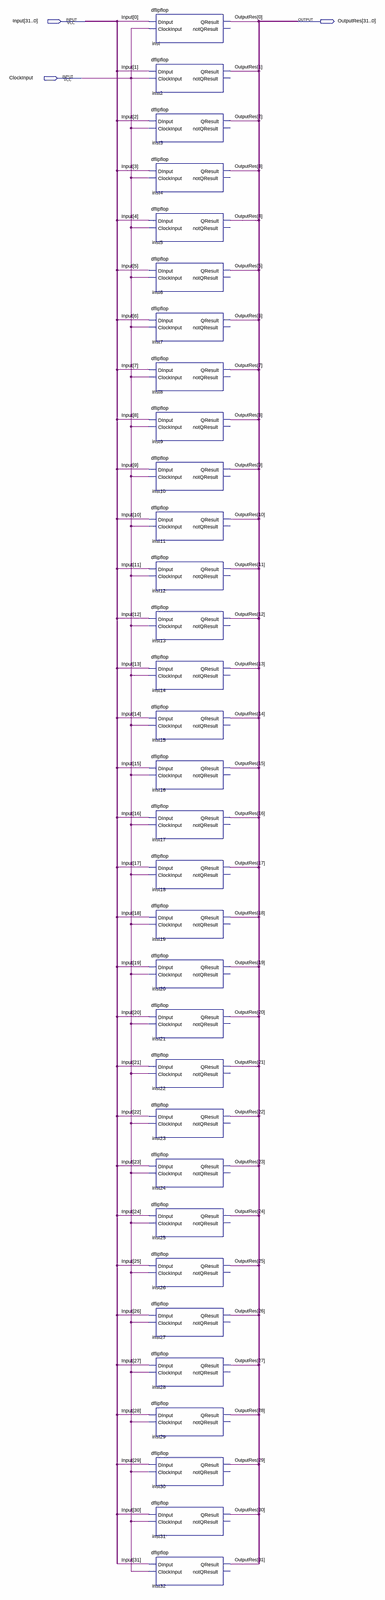
[diagram p0: schematic sheet, whole]
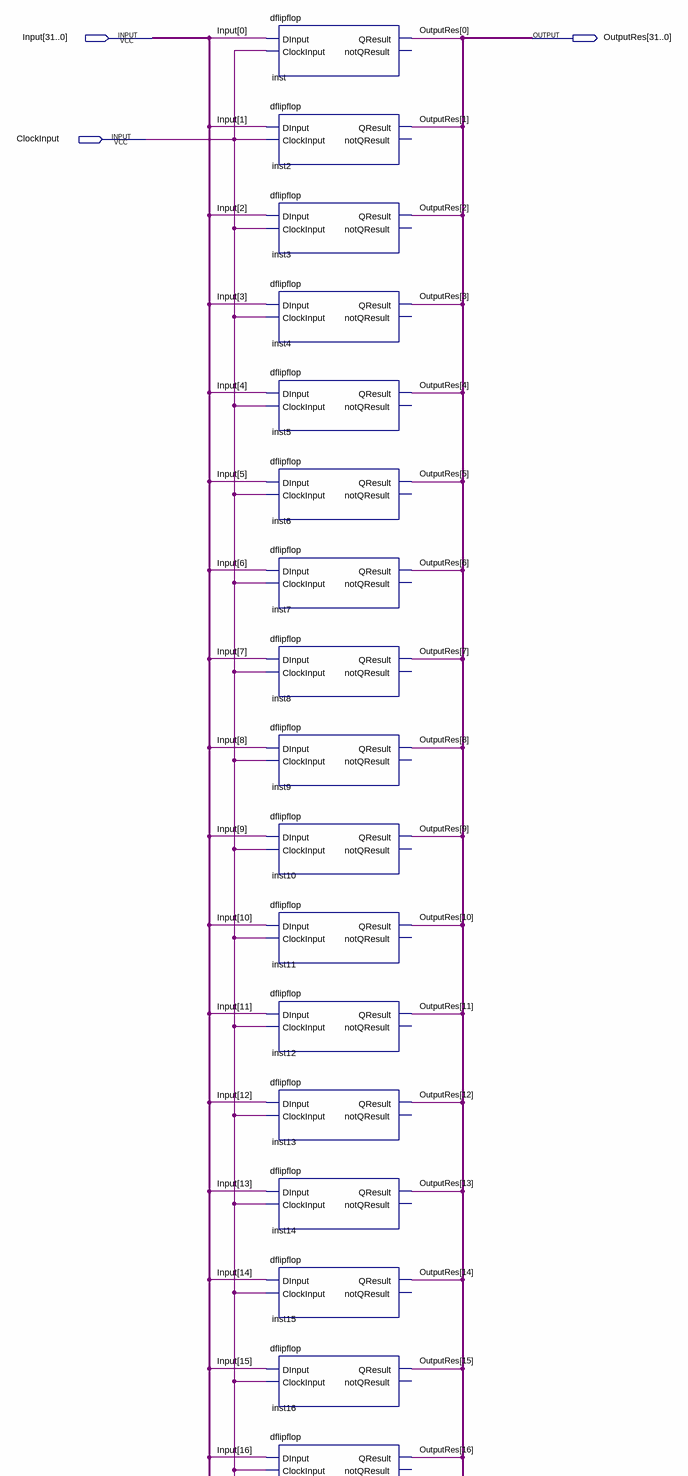
[diagram p1: schematic sheet, upper part]
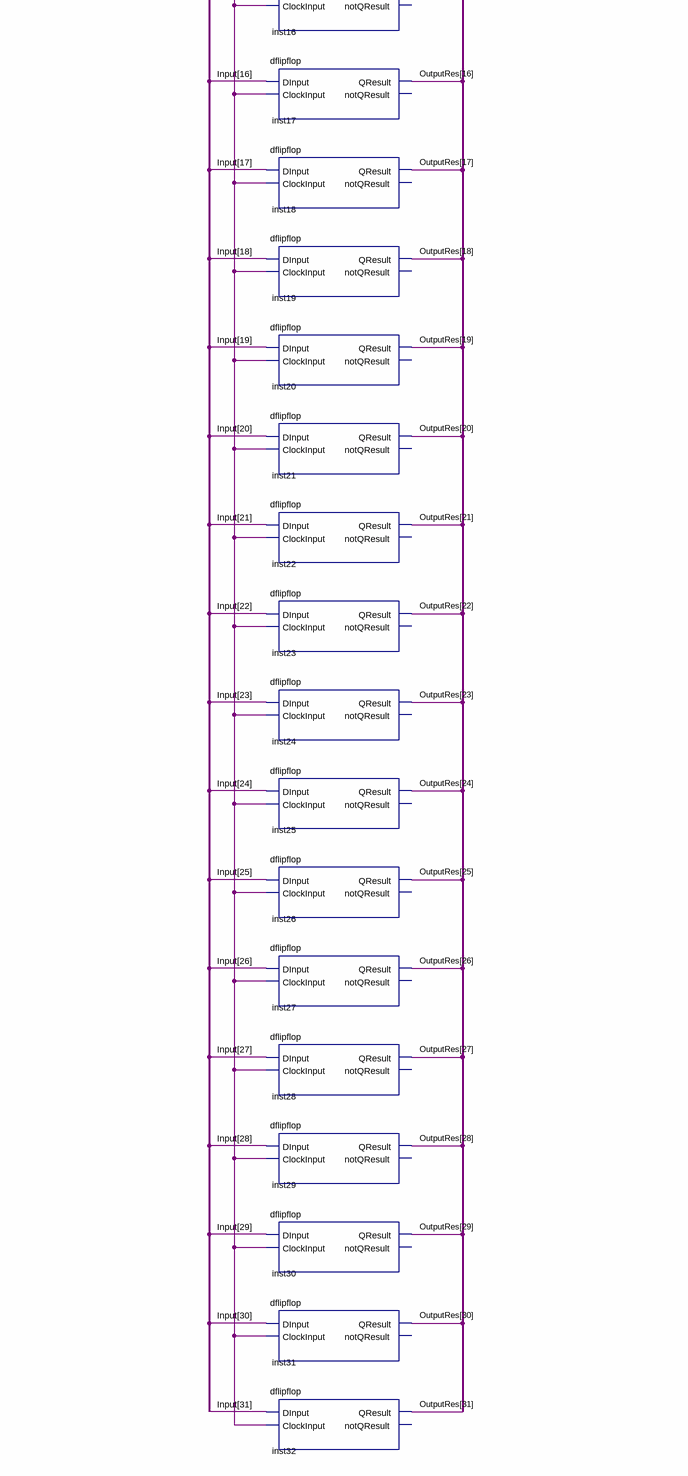
[diagram p2: schematic sheet, lower part]
// Quartus schematic dflipflop32bit.bdf as structural Verilog: 32 symbols, 3 pins
module dflipflop32bit (
  input  [31:0] Input,
  input  ClockInput,
  output [31:0] OutputRes
);

  dflipflop inst (.DInput(Input[0]), .ClockInput(ClockInput), .QResult(OutputRes[0]));  // open: notQResult
  dflipflop inst2 (.DInput(Input[1]), .ClockInput(ClockInput), .QResult(OutputRes[1]));  // open: notQResult
  dflipflop inst3 (.DInput(Input[2]), .ClockInput(ClockInput), .QResult(OutputRes[2]));  // open: notQResult
  dflipflop inst4 (.DInput(Input[3]), .ClockInput(ClockInput), .QResult(OutputRes[3]));  // open: notQResult
  dflipflop inst5 (.DInput(Input[4]), .ClockInput(ClockInput), .QResult(OutputRes[4]));  // open: notQResult
  dflipflop inst6 (.DInput(Input[5]), .ClockInput(ClockInput), .QResult(OutputRes[5]));  // open: notQResult
  dflipflop inst7 (.DInput(Input[6]), .ClockInput(ClockInput), .QResult(OutputRes[6]));  // open: notQResult
  dflipflop inst8 (.DInput(Input[7]), .ClockInput(ClockInput), .QResult(OutputRes[7]));  // open: notQResult
  dflipflop inst9 (.DInput(Input[8]), .ClockInput(ClockInput), .QResult(OutputRes[8]));  // open: notQResult
  dflipflop inst10 (.DInput(Input[9]), .ClockInput(ClockInput), .QResult(OutputRes[9]));  // open: notQResult
  dflipflop inst11 (.DInput(Input[10]), .ClockInput(ClockInput), .QResult(OutputRes[10]));  // open: notQResult
  dflipflop inst12 (.DInput(Input[11]), .ClockInput(ClockInput), .QResult(OutputRes[11]));  // open: notQResult
  dflipflop inst13 (.DInput(Input[12]), .ClockInput(ClockInput), .QResult(OutputRes[12]));  // open: notQResult
  dflipflop inst14 (.DInput(Input[13]), .ClockInput(ClockInput), .QResult(OutputRes[13]));  // open: notQResult
  dflipflop inst15 (.DInput(Input[14]), .ClockInput(ClockInput), .QResult(OutputRes[14]));  // open: notQResult
  dflipflop inst16 (.DInput(Input[15]), .ClockInput(ClockInput), .QResult(OutputRes[15]));  // open: notQResult
  dflipflop inst17 (.DInput(Input[16]), .ClockInput(ClockInput), .QResult(OutputRes[16]));  // open: notQResult
  dflipflop inst18 (.DInput(Input[17]), .ClockInput(ClockInput), .QResult(OutputRes[17]));  // open: notQResult
  dflipflop inst19 (.DInput(Input[18]), .ClockInput(ClockInput), .QResult(OutputRes[18]));  // open: notQResult
  dflipflop inst20 (.DInput(Input[19]), .ClockInput(ClockInput), .QResult(OutputRes[19]));  // open: notQResult
  dflipflop inst21 (.DInput(Input[20]), .ClockInput(ClockInput), .QResult(OutputRes[20]));  // open: notQResult
  dflipflop inst22 (.DInput(Input[21]), .ClockInput(ClockInput), .QResult(OutputRes[21]));  // open: notQResult
  dflipflop inst23 (.DInput(Input[22]), .ClockInput(ClockInput), .QResult(OutputRes[22]));  // open: notQResult
  dflipflop inst24 (.DInput(Input[23]), .ClockInput(ClockInput), .QResult(OutputRes[23]));  // open: notQResult
  dflipflop inst25 (.DInput(Input[24]), .ClockInput(ClockInput), .QResult(OutputRes[24]));  // open: notQResult
  dflipflop inst26 (.DInput(Input[25]), .ClockInput(ClockInput), .QResult(OutputRes[25]));  // open: notQResult
  dflipflop inst27 (.DInput(Input[26]), .ClockInput(ClockInput), .QResult(OutputRes[26]));  // open: notQResult
  dflipflop inst28 (.DInput(Input[27]), .ClockInput(ClockInput), .QResult(OutputRes[27]));  // open: notQResult
  dflipflop inst29 (.DInput(Input[28]), .ClockInput(ClockInput), .QResult(OutputRes[28]));  // open: notQResult
  dflipflop inst30 (.DInput(Input[29]), .ClockInput(ClockInput), .QResult(OutputRes[29]));  // open: notQResult
  dflipflop inst31 (.DInput(Input[30]), .ClockInput(ClockInput), .QResult(OutputRes[30]));  // open: notQResult
  dflipflop inst32 (.DInput(Input[31]), .ClockInput(ClockInput), .QResult(OutputRes[31]));  // open: notQResult
endmodule
